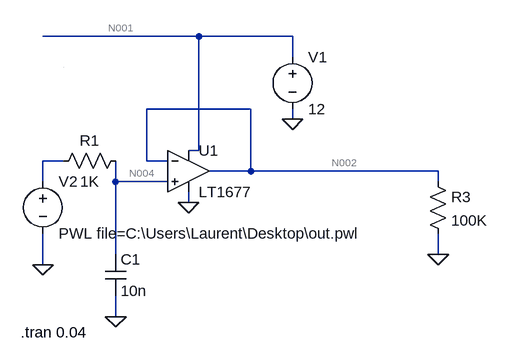
[diagram p0: schematic Draft1.asc]
Draft1.asc, the LTspice schematic file:
Version 4
SHEET 1 880 680
WIRE 208 -48 -32 -48
WIRE 352 -48 208 -48
WIRE 352 -16 352 -48
WIRE 288 64 128 64
WIRE 352 80 352 64
WIRE 208 128 208 -48
WIRE 208 128 192 128
WIRE 0 144 -32 144
WIRE 128 144 128 64
WIRE 160 144 128 144
WIRE 288 160 288 64
WIRE 288 160 224 160
WIRE 576 160 288 160
WIRE -32 176 -32 144
WIRE 80 176 80 144
WIRE 160 176 80 176
WIRE 576 176 576 160
WIRE 192 208 192 192
WIRE 80 288 80 176
WIRE 576 288 576 256
WIRE -32 304 -32 256
WIRE 80 384 80 352
WIRE 0 0 0 0
FLAG 352 80 0
FLAG -32 304 0
FLAG 576 288 0
FLAG 80 384 0
FLAG 192 208 0
SYMBOL voltage 352 -32 R0
WINDOW 123 0 0 Left 0
WINDOW 39 0 0 Left 0
SYMATTR InstName V1
SYMATTR Value 12
SYMBOL voltage -32 160 R0
WINDOW 123 0 0 Left 0
WINDOW 39 0 0 Left 0
SYMATTR InstName V2
SYMATTR Value PWL file=C:\Users\Laurent\Desktop\out.pwl
SYMBOL res 96 128 R90
WINDOW 0 0 56 VBottom 2
WINDOW 3 32 56 VTop 2
SYMATTR InstName R1
SYMATTR Value 1K
SYMBOL res 560 160 R0
SYMATTR InstName R3
SYMATTR Value 100K
SYMBOL cap 64 288 R0
SYMATTR InstName C1
SYMATTR Value 10n
SYMBOL Opamps\\LT1677 192 96 R0
SYMATTR InstName U1
TEXT -66 408 Left 2 !.tran 0.04

The netlist it stands for:
* Draft1.asc
V1 N001 0 12
V2 N003 0 PWL file=C:\Users\Laurent\Desktop\out.pwl
R1 N004 N003 1K
R3 N002 0 100K
C1 N004 0 10n
XU1 N004 N002 N001 0 N002 LT1677  ; pins In+ In- V+ V- OUT
.tran 0.04
.lib LTC.lib
.backanno
.end

* Results of the author's LTspice run, read from the files saved beside the schematic
* Operating Point, zero values left out:
*   V(n001) = 12 V
*   V(n004) = 393 µV
*   V(n002) = 36.7 mV
*   I(R3) = 367 nA
*   I(R1) = 393 nA
*   I(V2) = 393 nA
*   I(V1) = -1.758 mA
*   Ix(u1:1) = -393 nA
*   Ix(u1:2) = -393 nA
*   Ix(u1:3) = 1.758 mA
*   Ix(u1:4) = -1.757 mA
*   Ix(u1:5) = 26.05 nA